# Altium schematic sheet obc-v2_USB-HUB.SchDoc
size 420 x 297 mm; SheetNumber: 12; SheetTotal: 23
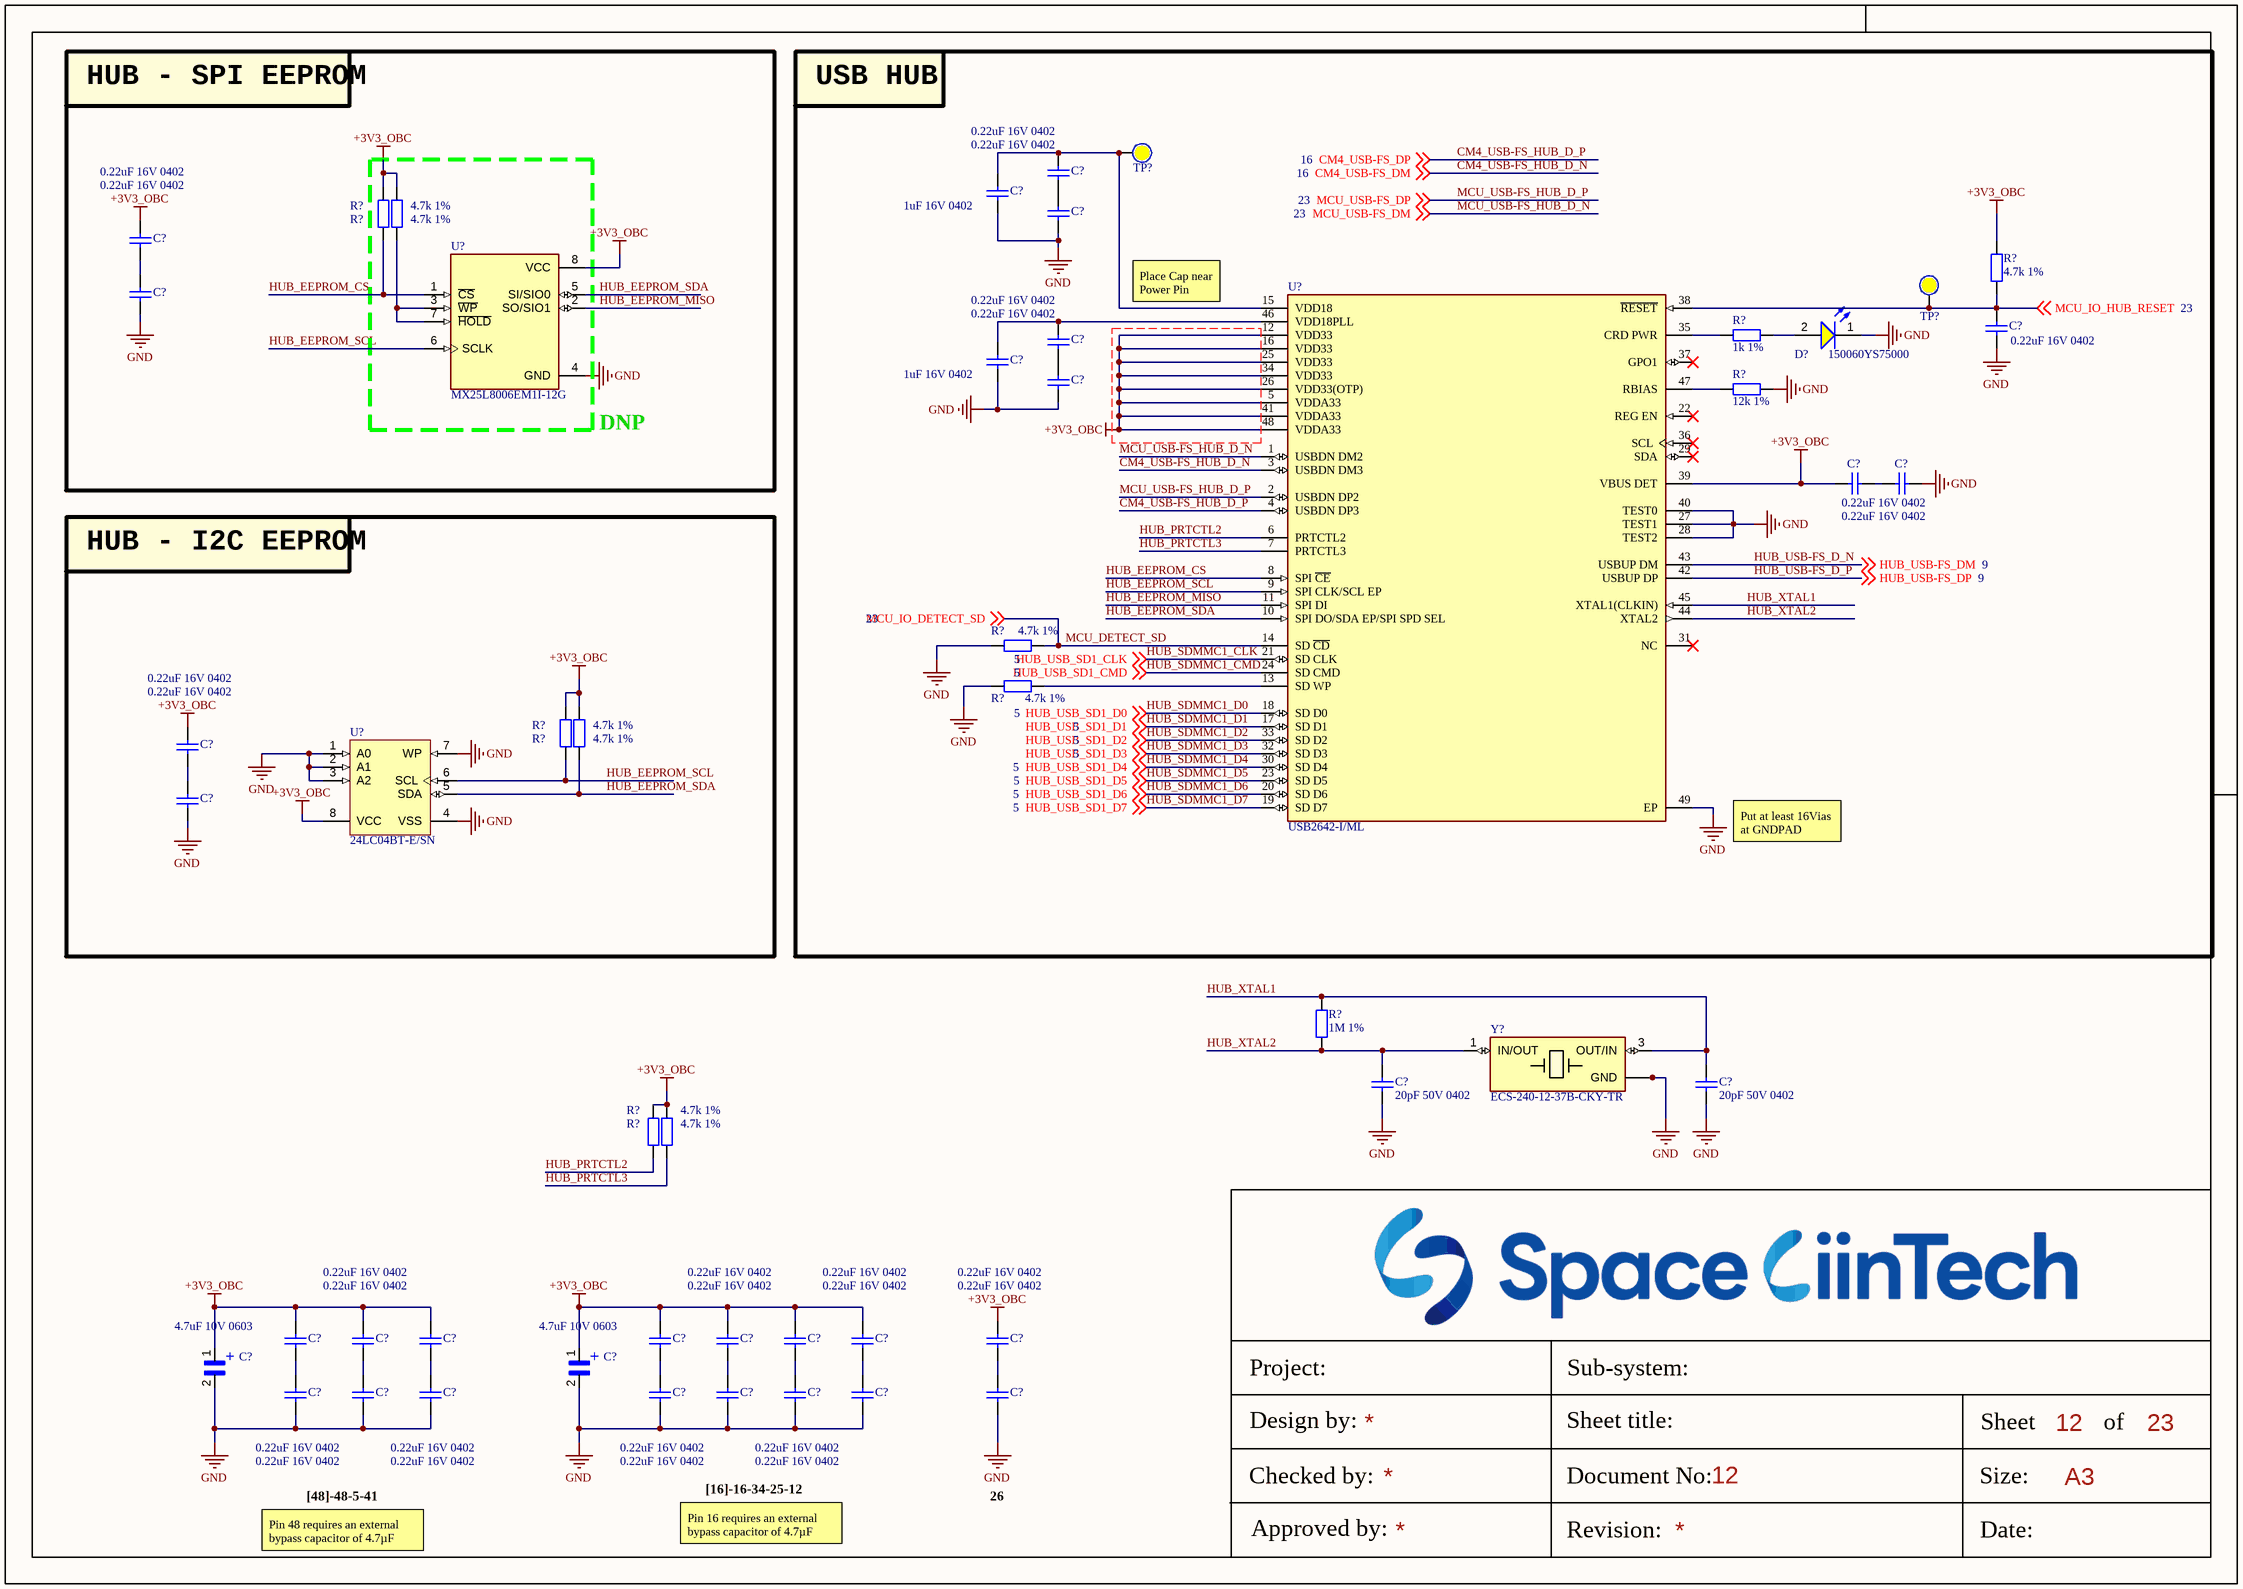
[diagram p0: obc-v2_USB-HUB.SchDoc]

## Parts
(Parts that share a designator on the sheet are numbered #1, #2 ... from top to bottom, then left to right.)
C?#1  0.22uF 16V 0402  [tu 0402]
C?#2  1uF 16V 0402  [tu 0402]
C?#3  0.22uF 16V 0402  [tu 0402]
C?#4  0.22uF 16V 0402  [tu 0402]
C?#5  0.22uF 16V 0402  [tu 0402]
C?#6  0.22uF 16V 0402  [tu 0402]
C?#7  0.22uF 16V 0402  [tu 0402]
C?#8  1uF 16V 0402  [tu 0402]
C?#9  0.22uF 16V 0402  [tu 0402]
C?#10  0.22uF 16V 0402  [tu 0402]
C?#11  0.22uF 16V 0402  [tu 0402]
C?#12  0.22uF 16V 0402  [tu 0402]
C?#13  0.22uF 16V 0402  [tu 0402]
C?#14  20pF 50V 0402  [tu 0402]
C?#15  20pF 50V 0402  [tu 0402]
C?#16  0.22uF 16V 0402  [tu 0402]
C?#17  0.22uF 16V 0402  [tu 0402]
C?#18  0.22uF 16V 0402  [tu 0402]
C?#19  0.22uF 16V 0402  [tu 0402]
C?#20  0.22uF 16V 0402  [tu 0402]
C?#21  0.22uF 16V 0402  [tu 0402]
C?#22  0.22uF 16V 0402  [tu 0402]
C?#23  0.22uF 16V 0402  [tu 0402]
C?#24  4.7uF 10V 0603  [CAPC1608X90]
C?#25  4.7uF 10V 0603  [CAPC1608X90]
C?#26  0.22uF 16V 0402  [tu 0402]
C?#27  0.22uF 16V 0402  [tu 0402]
C?#28  0.22uF 16V 0402  [tu 0402]
C?#29  0.22uF 16V 0402  [tu 0402]
C?#30  0.22uF 16V 0402  [tu 0402]
C?#31  0.22uF 16V 0402  [tu 0402]
C?#32  0.22uF 16V 0402  [tu 0402]
C?#33  0.22uF 16V 0402  [tu 0402]
D?  150060YS75000  [WL-SMCW_0603_150060xx75000]
R?#1  4.7k 1%  [tro smd 0603]
R?#2  4.7k 1%  [tro smd 0603]
R?#3  4.7k 1%  [tro smd 0603]
R?#4  1k 1%  [tro smd 0603]
R?#5  12k 1%  [tro smd 0603]
R?#6  4.7k 1%  [tro smd 0603]
R?#7  4.7k 1%  [tro smd 0603]
R?#8  4.7k 1%  [tro smd 0603]
R?#9  4.7k 1%  [tro smd 0603]
R?#10  1M 1%  [tro smd 0603]
R?#11  4.7k 1%  [tro smd 0603]
R?#12  4.7k 1%  [tro smd 0603]
TP?#1  (no value)  [Test Point 1 Side]  (no BOM)
TP?#2  (no value)  [Test Point 1 Side]  (no BOM)
U?#1  USB2642-I/ML  [FP-48QFN-5304-7x7B-IPC_A]
U?#2  MX25L8006EM1I-12G  [SOIC127P600X175-8N]
U?#3  24LC04BT-E/SN  [SOIC-SN8_L]
Y?  ECS-240-12-37B-CKY-TR  [XTAL_ECS-240-12-37B-CKY-TR]

## Blocks framed on the sheet
HUB - SPI EEPROM: C?#4 C?#5 R?#1 R?#2 U?#2
USB HUB: C?#1-C?#3 C?#6-C?#11 D? R?#3-R?#7 TP?#1 TP?#2 U?#1
HUB - I2C EEPROM: C?#12 C?#13 R?#8 R?#9 U?#3

## Nets
+3V3_OBC: C?#4.1 C?#10.1 C?#12.1 C?#16.1 C?#17.1 C?#18.1 C?#19.1 C?#20.1 C?#21.1 C?#22.1 C?#23.1 C?#24.1 C?#25.1 R?#1.2 R?#2.2 R?#3.1 R?#8.2 R?#9.2 R?#11.1 R?#12.1 U?#1.5(VDDA33) U?#1.12(VDD33) U?#1.16(VDD33) U?#1.25(VDD33) U?#1.26(VDD33(OTP)) U?#1.34(VDD33) U?#1.39(VBUS_DET) U?#1.41(VDDA33) U?#1.48(VDDA33) U?#2.8(VCC) U?#3.8(VCC)
GND: C?#2.1 C?#3.1 C?#5.2 C?#6.2 C?#8.1 C?#9.1 C?#11.2 C?#13.2 C?#14.1 C?#15.1 C?#24.2 C?#25.2 C?#26.2 C?#27.2 C?#28.2 C?#29.2 C?#30.2 C?#31.2 C?#32.2 C?#33.2 D?.1(K) R?#5.2 R?#6.1 R?#7.1 U?#1.27(TEST1) U?#1.28(TEST2) U?#1.40(TEST0) U?#1.49(EP) U?#2.4(GND) U?#3.1(A0) U?#3.2(A1) U?#3.3(A2) U?#3.4(VSS) U?#3.7(WP) Y?.2(GND) Y?.4(GND)
CM4_USB-FS_HUB_D_N: U?#1.3(USBDN_DM3) ; off-sheet CM4_USB-FS_DM  [also labelled CM4_USB-FS_DM]
CM4_USB-FS_HUB_D_P: U?#1.4(USBDN_DP3) ; off-sheet CM4_USB-FS_DP  [also labelled CM4_USB-FS_DP]
HUB_EEPROM_CS: R?#1.1 U?#1.8(SPI_~{CE}) U?#2.1(~{CS})
HUB_EEPROM_MISO: U?#1.11(SPI_DI) U?#2.2(SO/SIO1)
HUB_EEPROM_SCL: R?#8.1 U?#1.9(SPI_CLK/SCL_EP) U?#2.6(SCLK) U?#3.6(SCL)
HUB_EEPROM_SDA: R?#9.1 U?#1.10(SPI_DO/SDA_EP/SPI_SPD_SEL) U?#2.5(SI/SIO0) U?#3.5(SDA)
HUB_PRTCTL2: R?#11.2 U?#1.6(PRTCTL2)
HUB_PRTCTL3: R?#12.2 U?#1.7(PRTCTL3)
HUB_SDMMC1_CLK: U?#1.21(SD_CLK) ; off-sheet HUB_USB_SD1_CLK  [also labelled HUB_USB_SD1_CLK]
HUB_SDMMC1_CMD: U?#1.24(SD_CMD) ; off-sheet HUB_USB_SD1_CMD  [also labelled HUB_USB_SD1_CMD]
HUB_SDMMC1_D0: U?#1.18(SD_D0) ; off-sheet HUB_USB_SD1_D0  [also labelled HUB_USB_SD1_D0]
HUB_SDMMC1_D1: U?#1.17(SD_D1) ; off-sheet HUB_USB_SD1_D1  [also labelled HUB_USB_SD1_D1]
HUB_SDMMC1_D2: U?#1.33(SD_D2) ; off-sheet HUB_USB_SD1_D2  [also labelled HUB_USB_SD1_D2]
HUB_SDMMC1_D3: U?#1.32(SD_D3) ; off-sheet HUB_USB_SD1_D3  [also labelled HUB_USB_SD1_D3]
HUB_SDMMC1_D4: U?#1.30(SD_D4) ; off-sheet HUB_USB_SD1_D4  [also labelled HUB_USB_SD1_D4]
HUB_SDMMC1_D5: U?#1.23(SD_D5) ; off-sheet HUB_USB_SD1_D5  [also labelled HUB_USB_SD1_D5]
HUB_SDMMC1_D6: U?#1.20(SD_D6) ; off-sheet HUB_USB_SD1_D6  [also labelled HUB_USB_SD1_D6]
HUB_SDMMC1_D7: U?#1.19(SD_D7) ; off-sheet HUB_USB_SD1_D7  [also labelled HUB_USB_SD1_D7]
HUB_USB-FS_D_N: U?#1.43(USBUP_DM) ; off-sheet HUB_USB-FS_DM  [also labelled HUB_USB-FS_DM]
HUB_USB-FS_D_P: U?#1.42(USBUP_DP) ; off-sheet HUB_USB-FS_DP  [also labelled HUB_USB-FS_DP]
HUB_XTAL1: C?#15.2 R?#10.2 U?#1.45(XTAL1(CLKIN)) Y?.3(OUT/IN)
HUB_XTAL2: C?#14.2 R?#10.1 U?#1.44(XTAL2) Y?.1(IN/OUT)
MCU_DETECT_SD: R?#6.2 U?#1.14(SD_~{CD}) ; off-sheet MCU_IO_DETECT_SD  [also labelled MCU_IO_DETECT_SD]
MCU_IO_HUB_RESET: C?#6.1 R?#3.2 TP?#2.0 U?#1.38(~{RESET}) ; off-sheet MCU_IO_HUB_RESET
MCU_USB-FS_HUB_D_N: U?#1.1(USBDN_DM2) ; off-sheet MCU_USB-FS_DM  [also labelled MCU_USB-FS_DM]
MCU_USB-FS_HUB_D_P: U?#1.2(USBDN_DP2) ; off-sheet MCU_USB-FS_DP  [also labelled MCU_USB-FS_DP]
NetC?#1_1: C?#1.1 C?#3.2
NetC?#1_2: C?#1.2 C?#2.2 TP?#1.0 U?#1.15(VDD18)
NetC?#4_2: C?#4.2 C?#5.1
NetC?#7_1: C?#7.1 C?#9.2
NetC?#7_2: C?#7.2 C?#8.2 U?#1.46(VDD18PLL)
NetC?#10_2: C?#10.2 C?#11.1
NetC?#12_2: C?#12.2 C?#13.1
NetC?#16_2: C?#16.2 C?#26.1
NetC?#17_2: C?#17.2 C?#27.1
NetC?#18_2: C?#18.2 C?#28.1
NetC?#19_2: C?#19.2 C?#29.1
NetC?#20_2: C?#20.2 C?#30.1
NetC?#21_2: C?#21.2 C?#31.1
NetC?#22_2: C?#22.2 C?#32.1
NetC?#23_2: C?#23.2 C?#33.1
NetD?_2: D?.2(A) R?#4.1
NetR?#2_1: R?#2.1 U?#2.3(~{WP}) U?#2.7(~{HOLD})
NetR?#4_2: R?#4.2 U?#1.35(CRD_PWR)
NetR?#5_1: R?#5.1 U?#1.47(RBIAS)
NetR?#7_2: R?#7.2 U?#1.13(SD_WP)

Not connected (* = marked no-connect by the designer): U?#1 22(REG_EN)* 29(SDA)* 31(NC)* 36(SCL)* 37(GPO1)*

## Notes on the sheet
- Place Cap near Power Pin
- DNP
- Put at least 16Vias at GNDPAD
- [48]-48-5-41
- Pin 16 requires an external bypass capacitor of 4.7µF minimum.
- [16]-16-34-25-12
- 26
- Pin 48 requires an external bypass capacitor of 4.7µF minimum.
- Project:
- Sub-system:
- Design by:
- Sheet title:
- Sheet
- A3
- of
- Checked by:
- Approved by:
- Revision:
- Document No:
- Size:
- Date:
- (in symbol TACL335M003RTA) +

## Library data of the parts
C?#1-C?#13 C?#16-C?#23 C?#26-C?#33 = Tu 0402 33nF 10V: 0.22 µF ±10% 16V Ceramic Capacitor X7R 0402 (1005 Metric): GCM155R71C224KE02D; Chung_Loai: Dán; Don_Vi: Con; So_Chan: 2; Ten_Linh_Kien: Tụ 0402 33nF X7R 10V GRM155R71A333KA01D; Ma_Hang: MH007853; Kieu_Chan: *
C?#14 C?#15 = Tu 0402 33nF 10V: 27 pF ±1% 50V Ceramic Capacitor C0G, NP0 0402 (1005 Metric): GCQ1555C1H270FB01D; Chung_Loai: Dán; Don_Vi: Con; So_Chan: 2; Ten_Linh_Kien: Tụ 0402 33nF X7R 10V GRM155R71A333KA01D; Ma_Hang: MH007853; Kieu_Chan: *
C?#24 C?#25 = TACL335M003RTA: 4.7 µF Molded Tantalum Capacitors 10 V 0603 (1608 Metric) 6Ohm @ 100kHz: TP8M475M010C; Package: None; Price: None; Value: *; MP: TACL335M003RTA; Availability: Unavailable
D? = CMP-1426-00005-2: LED YELLOW CLEAR 0603 SMD; NexarPartId: 29687085; Wavelength: 590nm; Luminous Intensity: 120mcd; Peak Wavelength: 595nm; Forward Current: 100mA; Power Dissipation: 72mW; Forward Voltage: 2V; Test Current: 20mA; Reverse Voltage: 5V; Lens Style: Clear, Rectangular; Max Junction Temperature (Tj): 95°C; Viewing Angle: 140°; Case Code (Imperial): 0603; Height: 700µm; REACH SVHC: Unknown; Dominant Wavelength: 590nm; Min Operating Temperature: -40°C; Color: Yellow; Width: 800µm; Mount: Surface Mount; Packaging: Tape and Reel; Max Operating Temperature: 85°C; RoHS: Compliant; Max Reverse Voltage (DC): 5V; Case Code (Metric): 1608; Length: 1.6mm; Case/Package: 0603
R?#1-R?#3 R?#6-R?#9 = Tro 0603 1% 10k: RES 4.7K OHM 1% 1/10W 0603, P/N: ERJ-U03F4701V; Chung_Loai: Dán; Don_Vi: Con; So_Chan: 2; Ten_Linh_Kien: Trở 0603 1% 10k; Ma_Hang: MH006333; Kieu_Chan: *
R?#4 R?#11 R?#12 = Tro 0603 1% 10k: RES SMD 2.2K OHM 1% 1/10W 0603, P/N: ERJ-3EKF2201V; Chung_Loai: Dán; Don_Vi: Con; So_Chan: 2; Ten_Linh_Kien: Trở 0603 1% 10k; Ma_Hang: MH006333; Kieu_Chan: *
R?#5 R?#10 = Tro 0603 1% 1k: RES SMD 12K OHM 1% 1/10W 0603, P/N: ERJ-3EKF1202V; Chung_Loai: Dán; So_Chan: 2; Don_Vi: Con; Ten_Linh_Kien: Trở 0603 1% 1k; Ma_Hang: MH006334; Kieu_Chan: *
TP?#1 TP?#2 = Test Point: Solder: NF
U?#1 = CMP-06284-000083-1: IC INTERFACE SPECIALIZED 48QFN; Data Rate: 480Mbps; Interface: I2C; Number of Ports: 2; Operating Supply Voltage: 3.3V; Case/Package: QFN; Series: -; RoHS Compliant: Yes; Number of Pins: 48; Packaging: Tray; Package Quantity: 260; Max Operating Temperature: 85°C; Weight: 0.005309oz; Mount: Surface Mount; Min Operating Temperature: -40°C
U?#2 = MX25L8006EM1I-12G: FLASH - NOR Memory IC 8Mb (1M x 8) SPI 86 MHz 8-SOP; MF: Macronix; SnapEDA_Link: https://www.snapeda.com/parts/MX25L8006EM1I-12G/Macronix/view-part/?ref=snap; Package: SOP-8 Macronix; Value: *; MP: MX25L8006EM1I-12G; Check_prices: https://www.snapeda.com/parts/MX25L8006EM1I-12G/Macronix/view-part/?ref=eda
U?#3 = CMP-0159-00349-1: 4Kbit, 400kHz, 2.5V, I2C Serial EEPROM, 8-Pin SOIC 150mil, Extended Temperature, Tape and Reel; Code_IPC: SOIC127P600-8; Code_JEDEC: MS-012; PackageVersion: revBB, Aug-2009; DatasheetVersion: revK, Mar-2009; PackageDescription: 8-Lead Plastic Small Outline (SN) - Narrow, 3.90mm Body [SOIC]; PackageReference: SOIC-SN8
Y? = ECS-240-12-37B-CKY-TR: Package: None; Price: None; Value: *; MP: ECS-240-12-37B-CKY-TR; Availability: Unavailable